# Altium schematic sheet E72.SchDoc
size A; SheetNumber: 1; SheetTotal: 1
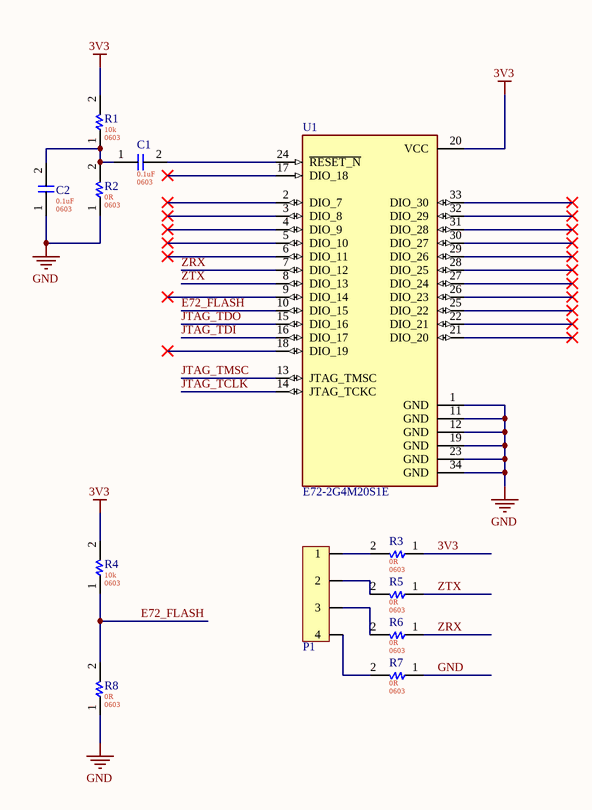
[diagram p0: E72.SchDoc]

## Parts
C1  FP: 0603  [0603 C]  (hidden comment: 0.1uF)
C2  FP: 0603  [0603 C]  (hidden comment: 0.1uF)
P1  P4  [P4 - 2.54mm]  (value not drawn)
R1  FP: 0603  [RES 0603]  (hidden comment: 10k)
R2  value 0R  FP: 0603  [RES 0603]  (hidden comment: 10k)
R3  value 0R  FP: 0603  [RES 0603]  (hidden comment: 10k)
R4  FP: 0603  [RES 0603]  (hidden comment: 10k)
R5  value 0R  FP: 0603  [RES 0603]  (hidden comment: 10k)
R6  value 0R  FP: 0603  [RES 0603]  (hidden comment: 10k)
R7  value 0R  FP: 0603  [RES 0603]  (hidden comment: 10k)
R8  value 0R  FP: 0603  [RES 0603]  (hidden comment: 10k)
U1  E72-2G4M20S1E  [Module_E72]

## Nets
3V3: R1.2 R3.1 R4.2 U1.20(VCC)
GND: C2.1 R2.1 R7.1 R8.1 U1.1(GND) U1.11(GND) U1.12(GND) U1.19(GND) U1.23(GND) U1.34(GND)
E72_FLASH: R4.1 R8.2 U1.10(DIO_15)
JTAG_TCLK: U1.14(JTAG_TCKC)
JTAG_TDI: U1.16(DIO_17)
JTAG_TDO: U1.15(DIO_16)
JTAG_TMSC: U1.13(JTAG_TMSC)
ZRX: R6.1 U1.7(DIO_12)
ZTX: R5.1 U1.8(DIO_13)
NetC1_1: C1.1 C2.2 R1.1 R2.2
NetC1_2: C1.2 U1.24(~{RESET_N})
NetP1_1: P1.1 R3.2
NetP1_2: P1.2 R5.2
NetP1_3: P1.3 R6.2
NetP1_4: P1.4 R7.2

Not connected (* = marked no-connect by the designer): U1 2(DIO_7)* 3(DIO_8)* 4(DIO_9)* 5(DIO_10)* 6(DIO_11)* 9(DIO_14)* 17(DIO_18)* 18(DIO_19)* 21(DIO_20)* 22(DIO_21)* 25(DIO_22)* 26(DIO_23)* 27(DIO_24)* 28(DIO_25)* 29(DIO_26)* 30(DIO_27)* 31(DIO_28)* 32(DIO_29)* 33(DIO_30)*

## Library data of the parts
C1 C2 = 0603 0.1uF CER: CAP CER 0.1uF 50V 10% 0603 SMD; VOLTAGE + TOLE: 50V 10%; PACKAGE: SMD; DATE: 04-Mar-21; CREATOR: MMUOP; ComponentLink1Description: New link; ComponentLink1URL: *; VALUE: 0.1uF
R1 R4 = 0603 10k 1%: 10k 1% 0603 SMD; PN: C98220; PACKAGE: SMD; DATE: 04-Mar-21; CREATOR: MMUOP; ComponentLink1Description: New link; ComponentLink1URL: *; VOLTAGE + TOLE: 1%; VALUE: 10k
R2 R3 R5-R8 = 0603 10k 1%: 0R 1% 0603 SMD; PN: C98220; PACKAGE: SMD; DATE: 04-Mar-21; CREATOR: MMUOP; ComponentLink1Description: New link; ComponentLink1URL: *; VOLTAGE + TOLE: 1%
U1 = E72-2G4M20S1E: CC2652P Multifunctional SoC wireless module; MF: EBYTE; Package: Package; Value: *; SnapEDA_Link: https://www.snapeda.com/parts/E72-2G4M20S1E/EBYTE/view-part/5825256/?ref=snap; Price: None; MP: E72-2G4M20S1E; Check_prices: https://www.snapeda.com/parts/E72-2G4M20S1E/EBYTE/view-part/5825256/?ref=eda; Availability: Unavailable